# EAGLE design ZEROCROSS_ATmega328 (EAGLE 6.5.0)
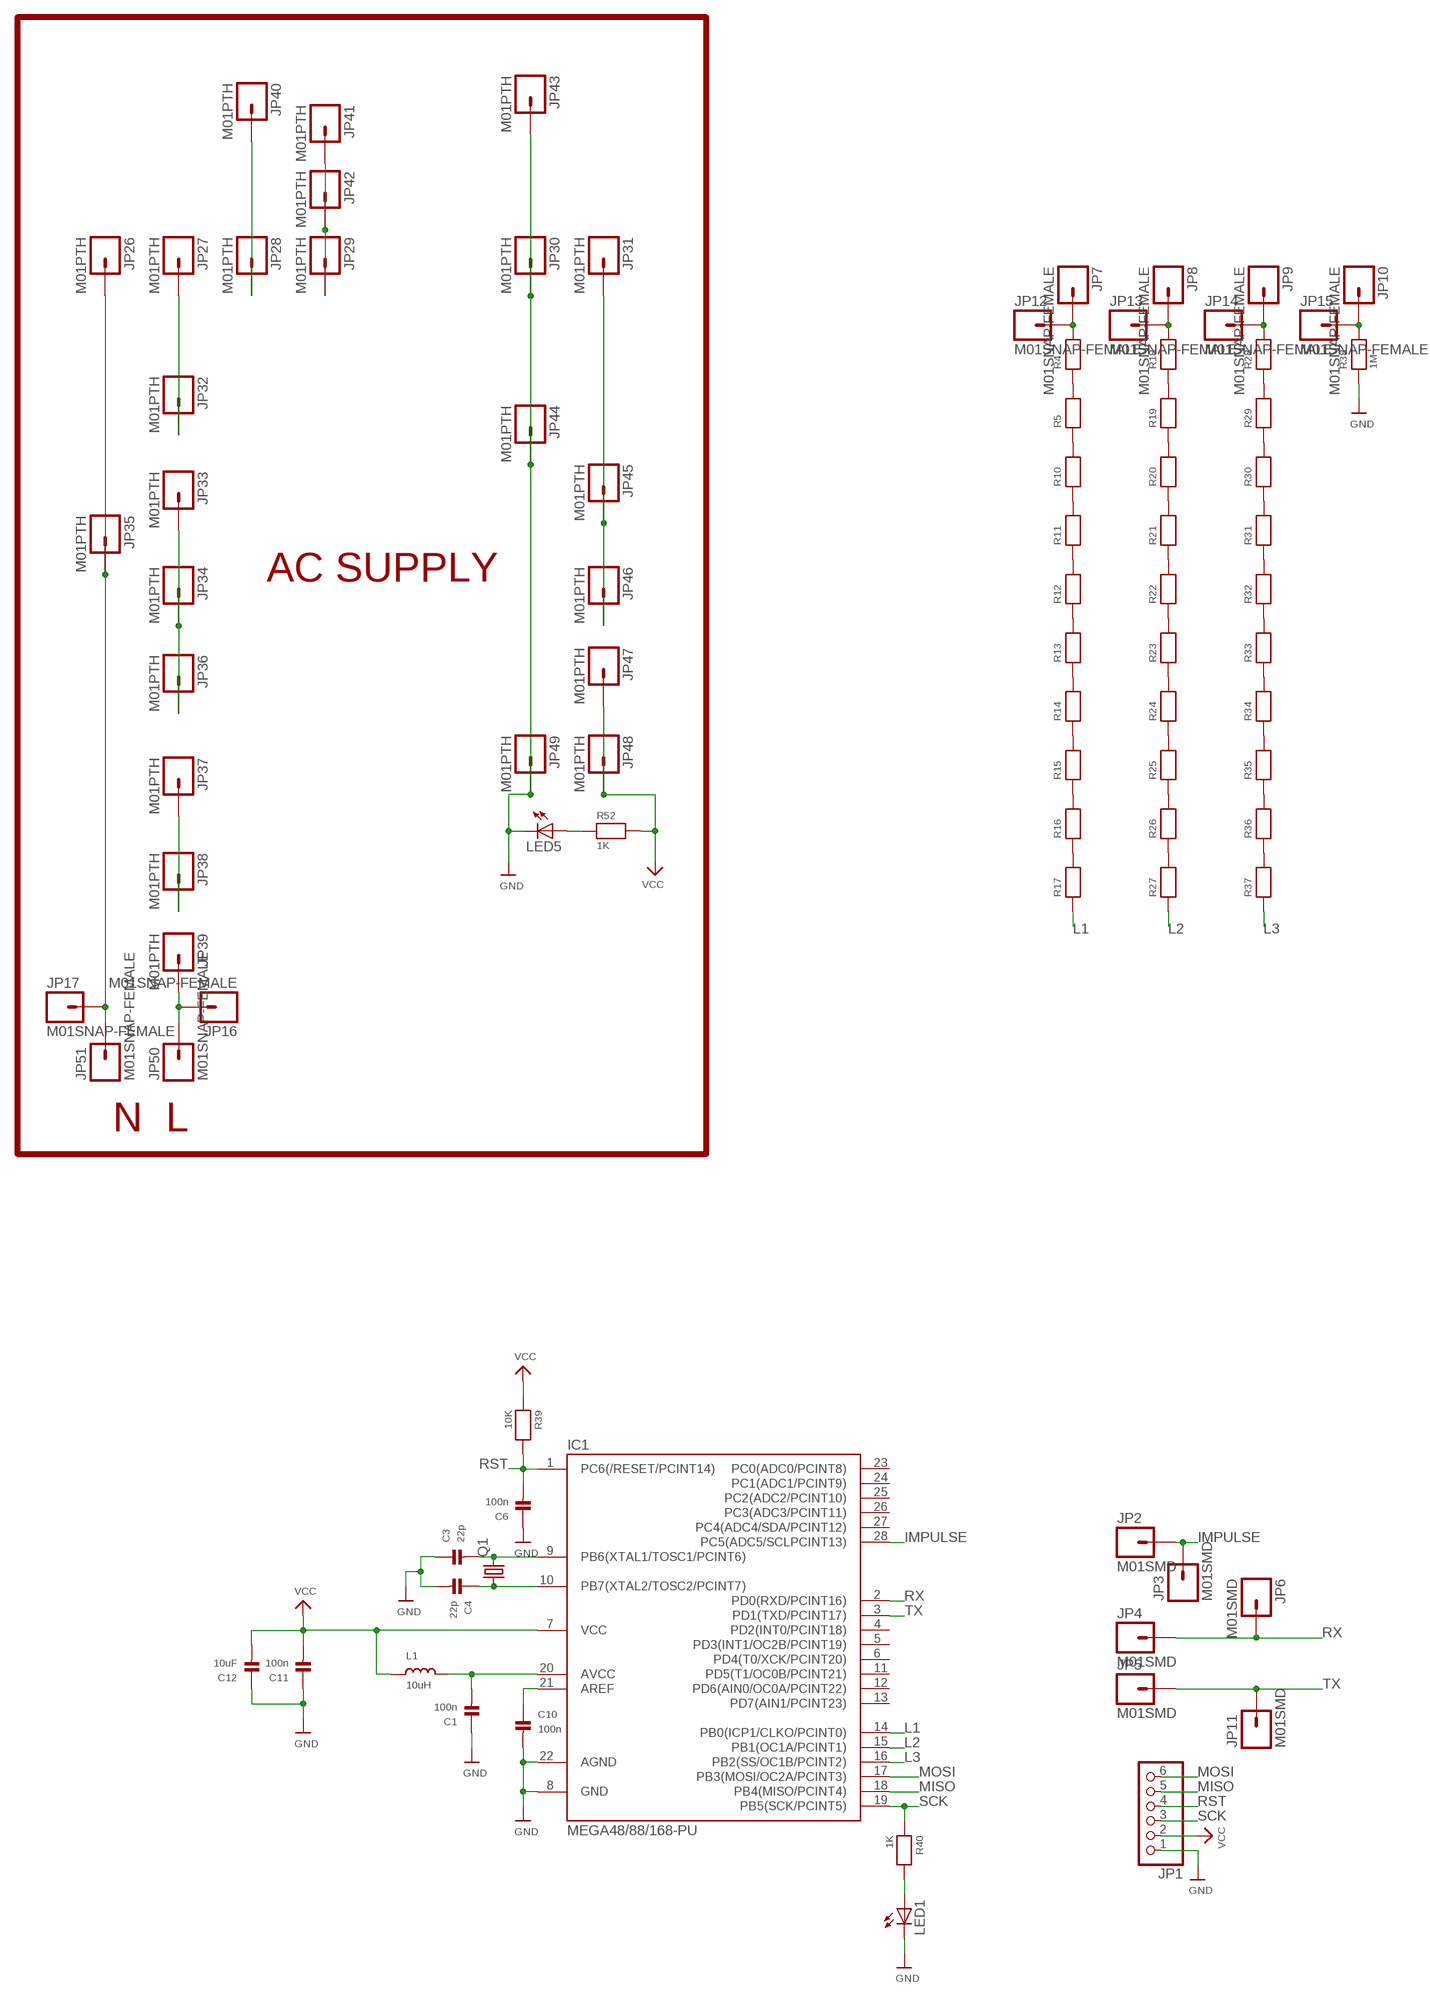
[diagram p0: schematic, sheet 1]

## Parts
C1  100n  CAP_CERAMIC_0805MP  [_0805MP]
C3  22p  CAP_CERAMIC_0805MP  [_0805MP]
C4  22p  CAP_CERAMIC_0805MP  [_0805MP]
C6  100n  CAP_CERAMIC_0805MP  [_0805MP]
C10  100n  CAP_CERAMIC_0805MP  [_0805MP]
C11  100n  CAP_CERAMIC_0805MP  [_0805MP]
C12  10uF  CAP_CERAMIC_0805MP  [_0805MP]
IC1  MEGA48/88/168-PU  [DIL28-3]
JP1  HEADER-1X6  [1X06_OVAL]
JP2  M01SMD  [LUXEON-PAD]
JP3  M01SMD  [LUXEON-PAD]
JP4  M01SMD  [LUXEON-PAD]
JP5  M01SMD  [LUXEON-PAD]
JP6  M01SMD  [LUXEON-PAD]
JP7  M01SNAP-FEMALE  [SNAP-FEMALE]
JP8  M01SNAP-FEMALE  [SNAP-FEMALE]
JP9  M01SNAP-FEMALE  [SNAP-FEMALE]
JP10  M01SNAP-FEMALE  [SNAP-FEMALE]
JP11  M01SMD  [LUXEON-PAD]
JP12  M01SNAP-FEMALE  [SNAP-FEMALE]
JP13  M01SNAP-FEMALE  [SNAP-FEMALE]
JP14  M01SNAP-FEMALE  [SNAP-FEMALE]
JP15  M01SNAP-FEMALE  [SNAP-FEMALE]
JP16  M01SNAP-FEMALE  [SNAP-FEMALE]
JP17  M01SNAP-FEMALE  [SNAP-FEMALE]
JP26  M01PTH  [1X01]
JP27  M01PTH  [1X01]
JP28  M01PTH  [1X01]
JP29  M01PTH  [1X01]
JP30  M01PTH  [1X01]
JP31  M01PTH  [1X01]
JP32  M01PTH  [1X01]
JP33  M01PTH  [1X01]
JP34  M01PTH  [1X01]
JP35  M01PTH  [1X01]
JP36  M01PTH  [1X01]
JP37  M01PTH  [1X01]
JP38  M01PTH  [1X01]
JP39  M01PTH  [1X01]
JP40  M01PTH  [1X01]
JP41  M01PTH  [1X01]
JP42  M01PTH  [1X01]
JP43  M01PTH  [1X01]
JP44  M01PTH  [1X01]
JP45  M01PTH  [1X01]
JP46  M01PTH  [1X01]
JP47  M01PTH  [1X01]
JP48  M01PTH  [1X01]
JP49  M01PTH  [1X01]
JP50  M01SNAP-FEMALE  [SNAP-FEMALE]
JP51  M01SNAP-FEMALE  [SNAP-FEMALE]
L1  10uH  INDUCTOR_0805MP  [_0805MP]
LED1  LED-3MM-NO_SILK  [LED3MM-NS]
LED5  LED-3MM-NO_SILK  [LED3MM-NS]
Q1  CRYSTALHC49U-V  [HC49U-V]
R4  RESISTOR1206  [1206]
R5  RESISTOR1206  [1206]
R10  RESISTOR1206  [1206]
R11  RESISTOR1206  [1206]
R12  RESISTOR1206  [1206]
R13  RESISTOR1206  [1206]
R14  RESISTOR1206  [1206]
R15  RESISTOR1206  [1206]
R16  RESISTOR1206  [1206]
R17  RESISTOR1206  [1206]
R18  RESISTOR1206  [1206]
R19  RESISTOR1206  [1206]
R20  RESISTOR1206  [1206]
R21  RESISTOR1206  [1206]
R22  RESISTOR1206  [1206]
R23  RESISTOR1206  [1206]
R24  RESISTOR1206  [1206]
R25  RESISTOR1206  [1206]
R26  RESISTOR1206  [1206]
R27  RESISTOR1206  [1206]
R28  RESISTOR1206  [1206]
R29  RESISTOR1206  [1206]
R30  RESISTOR1206  [1206]
R31  RESISTOR1206  [1206]
R32  RESISTOR1206  [1206]
R33  RESISTOR1206  [1206]
R34  RESISTOR1206  [1206]
R35  RESISTOR1206  [1206]
R36  RESISTOR1206  [1206]
R37  RESISTOR1206  [1206]
R38  1M  RESISTOR1206  [1206]
R39  10K  RESISTOR_0805MP  [_0805MP]
R40  1K  RESISTOR_0805MP  [_0805MP]
R52  1K  RESISTOR_0805MP  [_0805MP]

## Nets
IMPULSE: IC1.28(PC5(ADC5/SCLPCINT13)) JP2.P$1 JP3.P$1
L1: IC1.14(PB0(ICP1/CLKO/PCINT0)) R17.1
L2: IC1.15(PB1(OC1A/PCINT1)) R27.1
L3: IC1.16(PB2(SS/OC1B/PCINT2)) R37.1
MISO: IC1.18(PB4(MISO/PCINT4)) JP1.5
MOSI: IC1.17(PB3(MOSI/OC2A/PCINT3)) JP1.6
N$2: C1.2 IC1.20(AVCC) L1.2
N$4: C11.2 C12.2 IC1.7(VCC) JP1.2 JP47.1 JP48.1 L1.1 R39.1 R52.2 ; supply symbol labelled VCC
N$5: R4.1 R5.2
N$6: R5.1 R10.2
N$7: R10.1 R11.2
N$8: R11.1 R12.2
N$9: R12.1 R13.2
N$14: R13.1 R14.2
N$15: R14.1 R15.2
N$16: R15.1 R16.2
N$17: R16.1 R17.2
N$18: R18.1 R19.2
N$19: R19.1 R20.2
N$20: R20.1 R21.2
N$21: R21.1 R22.2
N$22: R22.1 R23.2
N$23: R23.1 R24.2
N$24: R24.1 R25.2
N$25: R25.1 R26.2
N$26: R26.1 R27.2
N$27: R28.1 R29.2
N$28: R29.1 R30.2
N$29: R30.1 R31.2
N$30: R31.1 R32.2
N$31: R32.1 R33.2
N$32: R33.1 R34.2
N$33: R34.1 R35.2
N$34: R35.1 R36.2
N$35: R36.1 R37.2
N$36: C3.2 IC1.9(PB6(XTAL1/TOSC1/PCINT6)) Q1.2
N$37: C4.1 IC1.10(PB7(XTAL2/TOSC2/PCINT7)) Q1.1
N$38: C10.1 IC1.21(AREF)
N$39: C1.1 C3.1 C4.2 C6.1 C10.2 C11.1 C12.1 IC1.8(GND) IC1.22(AGND) JP1.1 JP30.1 JP43.1 JP44.1 JP49.1 LED1.K(C) LED5.K(C) R38.1 ; supply symbol labelled GND
N$40: JP7.1 JP12.1 R4.2
N$41: JP8.1 JP13.1 R18.2
N$42: JP9.1 JP14.1 R28.2
N$43: JP10.1 JP15.1 R38.2
N$45: LED1.A R40.2
N$60: JP17.1 JP26.1 JP35.1 JP51.1
N$61: JP27.1 JP32.1
N$62: JP33.1 JP34.1 JP36.1
N$63: JP37.1 JP38.1
N$64: JP16.1 JP39.1 JP50.1
N$65: JP28.1 JP40.1
N$66: JP29.1 JP41.1 JP42.1
N$68: JP31.1 JP45.1 JP46.1
N$70: LED5.A R52.1
RST: C6.2 IC1.1(PC6(/RESET/PCINT14)) JP1.4 R39.2
RX: IC1.2(PD0(RXD/PCINT16)) JP4.P$1 JP6.P$1
SCK: IC1.19(PB5(SCK/PCINT5)) JP1.3 R40.1
TX: IC1.3(PD1(TXD/PCINT17)) JP5.P$1 JP11.P$1
Unconnected: IC1.4(PD2(INT0/PCINT18)) IC1.5(PD3(INT1/OC2B/PCINT19)) IC1.6(PD4(T0/XCK/PCINT20)) IC1.11(PD5(T1/OC0B/PCINT21)) IC1.12(PD6(AIN0/OC0A/PCINT22)) IC1.13(PD7(AIN1/PCINT23)) IC1.23(PC0(ADC0/PCINT8)) IC1.24(PC1(ADC1/PCINT9)) IC1.25(PC2(ADC2/PCINT10)) IC1.26(PC3(ADC3/PCINT11)) IC1.27(PC4(ADC4/SDA/PCINT12))

## Notes on the sheet
- AC SUPPLY
- N  L

## Library data of the parts
C1 C3 C4 C6 C10-C12 = microbuilder:CAP_CERAMIC: Ceramic Capacitors 0402 - 0402 Surface Mount Capacitors 16pF 50V 5% [Digikey: 445-4899-2-ND] 18pF 50V 5% [Digikey: 490-1281-2-ND] 22pF 50V 5% [Digikey: 490-1283-2-ND] 68pF 50V 5% [Digikey: 490-1289-2-ND] 0.1uF 10V 10% [Digikey: 490-1318-2-ND] 1.0uF 6.3V 10% [Digikey: 490-1320-2-ND] 0603 - 0603 Surface Mount Capacitors 16 pF 50V 5% [Digikey: 445-5051-2-ND] 22 pF 50V [Digikey: PCC220ACVTR-ND] 33 pF 50V 5% [Digikey: 490-1415-1-ND] 56pF 50V 5% [Digikey: 490-1421-1-ND] 220pF 50V 5% [Digikey: 445-1285-1-ND] 680 pF 50V 2200 pF 50V 5% C0G [Digikey: 445-1297-1-ND] 5600 pF 100V 5% X7R [Digikey: 478-3711-1-ND] 0.1 µF 25V 10% [Digikey: PCC2277TR-ND] 0.22 µF 16V 10% X7R [Digikey: 445-1318-1-ND] 1.0 µF 25V 10% [Digikey: 445-5146-2-ND] 0603 - RF Specific 3pF 250V +/-0.1pF RF [Digikey: 712-1347-1-ND] 18 pF 250V 5% [Digikey: 478-3505-1-ND or 712-1322-1-ND] 56 pF 250V 5% C0G RF [Digikey: 490-4867-1-ND] 68 pF 250V RF [Digikey: 490-4868-1-ND] 0805 - 0805 Surface Mount Capacitors 220 pF 250V 2% RF Ceramic Capacitor [Digikey: 712-1398-1-ND] 1000 pF 50V 2% NP0 Ceramic Capacitor [Digikey: 478-3760-1-ND] 0.1 µF 25V 10% Ceramic Capacitor [Digikey: PCC1828TR-ND] 1.0 µF 16V 10% Ceramic Capacitor[Digikey: 490-1691-2-ND] 10.0 µF 10V 10% Ceramic Capacitor[Digikey: 709-1228-1-ND] 10.0 uF 16V 10% Ceramic Capacitor [Digikey: 478-5165-2-ND] 47 uF 6.3V 20% Ceramic Capacitor [Digikey: 587-1779-1-ND or 399-5506-1-ND] 1206 - 1206 Surface Mount Capacitors 47uF 10V 20% Ceramic Capacitor [Digikey: 490-5528-1-ND or 399-5508-1-ND or 445-6010-1-ND] 100uF 6.3V -20%, +80% Y5V Ceramic Capacitor (Digikey: 490-4512-1-ND, Mouser: 81-GRM31CF50J107ZE1L)
IC1 = avr-7:MEGA48/88/168-PU
JP1 = microbuilder:HEADER-1X6: PIN HEADER
JP2-JP17 JP26-JP51 = SparkFun-Connectors:M01: Header 1 Standard 1-pin 0.1" header. Use with straight break away headers (SKU : PRT-00116), right angle break away headers (PRT-00553), swiss pins (PRT-00743), machine pins (PRT-00117), and female headers (PRT-00115).
L1 = microbuilder:INDUCTOR: Inductors 0603: 10nH Ceramic Inductor - microwire antenna/RF (Digikey: 712-1434-2-ND) 0805: 560nH Ceramic Inductor - RF (Digikey: 553-1047-1-ND) 270nH Ceramic Inductor - Q = 40@250MHz, +-5%, 1 Ohm DC Resistance (Digikey: 535-10506-2-ND) 1007 (2518 Metric) SMT: 10µH 10% 250mOhm 820mA 1007 Inductor (Digikey: 587-2189-1-ND) 22µH 10% 500mOhm 580mA 1007 Inductor (Digikey: 587-2190-1-ND) 47µH 10% 950mOhm 420mA 1007 Inductor (Digikey: 587-2191-1-ND) 47µH 5% 100mOhm 1A 1008 Inductor (Digikey: 732-1816-1-ND) 5.0x5.0mm (Taiyo Yuden NR5040 Series) 6.8µH 20% 2.3A 64mOhm Inductor (Digikey: 587-2374-2-ND) 5.0x5.0mm (TDK VLC5045 Series) 4.7µH 20% 3.3A 34mOhm Inductor (Digikey: 445-6526-1-ND) 6.8µH 20% 2.7A 46mOhm Inductor (Digikey: 445-6527-1-ND) 6.0x6.0mm (TDK VLC6045 Series) 4.7µH 20% 3.8A 27mOhm Inductor (Digikey: 445-6538-2-ND) 6.8µH 20% 3A 41mOhm Inductor (Digikey: 445-6540-1-ND) 6.2µH 30% 2.2A 45mOhm Inductor (Digikey: SRR5028-6R2YCT-ND) - Not TDK VLC6045 but footprint should match 6.0x6.0mm (TDK SLF6045 Series) 6.8uH 30% 2A 33mOhm Inductor (Digikey: 445-4572-1-ND, Mouser: 810-SLF645T6R8N2R0PF)
LED1 LED5 = SparkFun-LED:LED: LEDs Standard schematic elements and footprints for 5mm, 3mm, 1206, and 0603 sized LEDs. 5mm - Spark Fun Electronics SKU : COM-00529 (and others)
Q1 = crystal:CRYSTAL: CRYSTAL; OC_FARNELL: 1666969; OC_NEWARK: unknown
R4 R5 R10-R40 R52 = microbuilder:RESISTOR: Resistors 0402 - 0402 Surface Mount Package 22 Ohm 1% 1/16W [Digikey: 311-22.0LRTR-ND] 33 Ohm 5% 1/16W 1.0K 5% 1/16W 1.5K 5% 1/16W 2.0K 1% 1/16W 10.0K 1% 1/16W [Digikey: 311-10.0KLRTR-ND] 10.0K 5% 1/16W [Digikey: RMCF0402JT10K0TR-ND] 12.1K 1% 1/16W [Digikey: 311-22.0LRTR-ND] 100.0K 5% 1/16W 0603 - 0603 Surface Mount Package 0 Ohm 1/10 Watt 1% Resistor 15 Ohm 1/10 Watt 1% Resistor 33 Ohm 1/10 Watt 1% Resistor 49.9 Ohm 1/10 Watt 1% Resistor 100 Ohm 1/10 Watt 1% Resistor 150 Ohm 1/10 Watt 1% Resistor 240 Ohm 1/10 Watt 1% Resistor 390 Ohm 1/10 Watt 1% Resistor 560 Ohm 1/10 Watt 1% Resistor 680 Ohm 1/10 Watt 1% Resistor 750 Ohm 1/10 Watt 1% Resistor 1.0K Ohm 1/10 Watt 1% Resistor 1.5K Ohm 1/10 Watt 1% Resistor 2.0K Ohm 1/10 Watt 1% Resistor 2.2K Ohm 1/10 Watt 1% Resistor 3.3K Ohm 1/10 Watt 1% Resistor 4.7K Ohm 1/10 Watt 1% Resistor 10.0K Ohm 1/10 Watt 1% Resistor 12.0K Ohm 1/10 Watt 1% Resistor 12.1K Ohm 1/10 Watt 1% Resistor 20.0K Ohm 1/10 Watt 1% Resistor 33.0K Ohm 1/10 Watt 1% Resistor 100.0K Ohm 1/10 Watt 1% Resistor 0805 - 0805 Surface Mount Package 0 Ohm 1/8 Watt 1% Resistor 33 Ohm 1/8 Watt 1% Resistor 100 Ohm 1/8 Watt 1% Resistor 150 Ohm 1/8 Watt 1% Resistor 200 Ohm 1/8 Watt 1% Resistor 240 Ohm 1/8 Watt 1% Resistor 330 Ohm 1/8 Watt 1% Resistor 390 Ohm 1/8 Watt 1% Resistor 470 Ohm 1/8 Watt 1% Resistor 1.0K Ohm 1/8 Watt 1% Resistor 1.5K Ohm 1/8 Watt 1% Resistor 2.0K Ohm 1/8 Watt 1% Resistor 4.7K Ohm 1/8 Watt 1% Resistor 5.1K Ohm 1/8 Watt 1% Resistor 5.6K Ohm 1/8 Watt 1% Resistor 10.0K Ohm 1/8 Watt 1% Resistor 22.0K Ohm 1/8 Watt 1% Resistor 33.0K Ohm 1/8 Watt 1% Resistor 100K Ohm 1/8 Watt 1% Resistor 1206 - 1206 Surface Mount Package 2012 - 2010 Surface Mount Package 0.11 Ohm 1/2 Watt 1% Resistor - Digikey: RHM.11UCT-ND

## Board
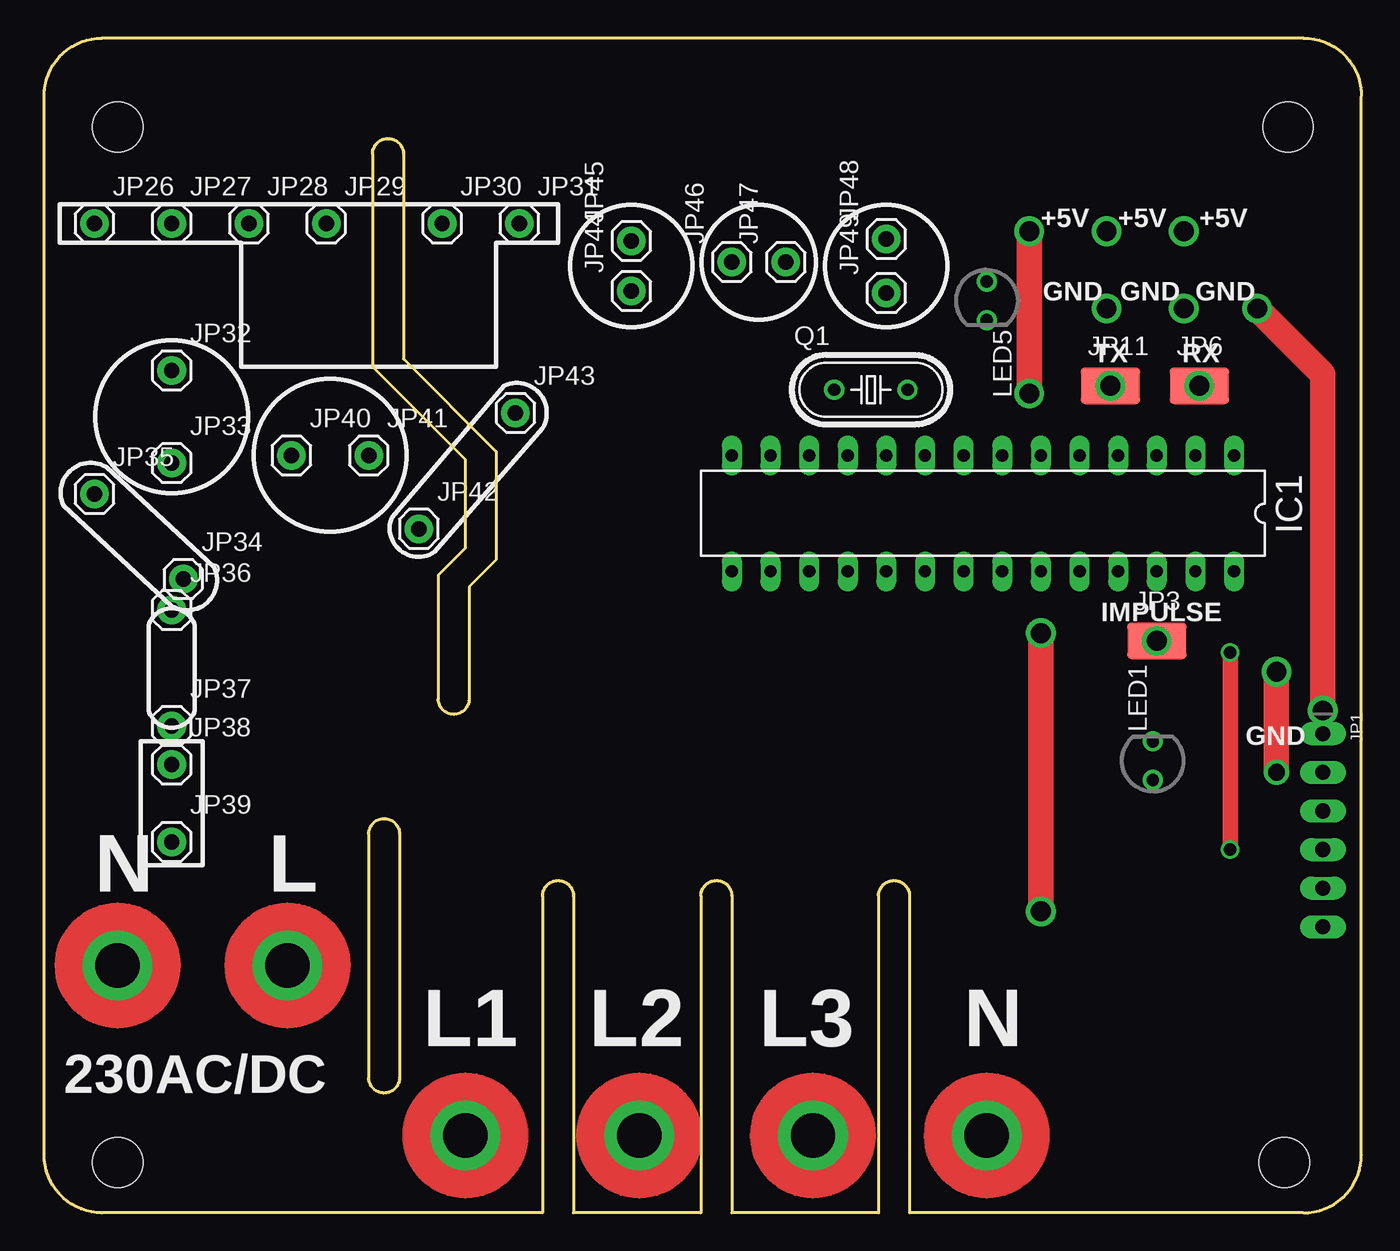
[diagram p1: board, top side]
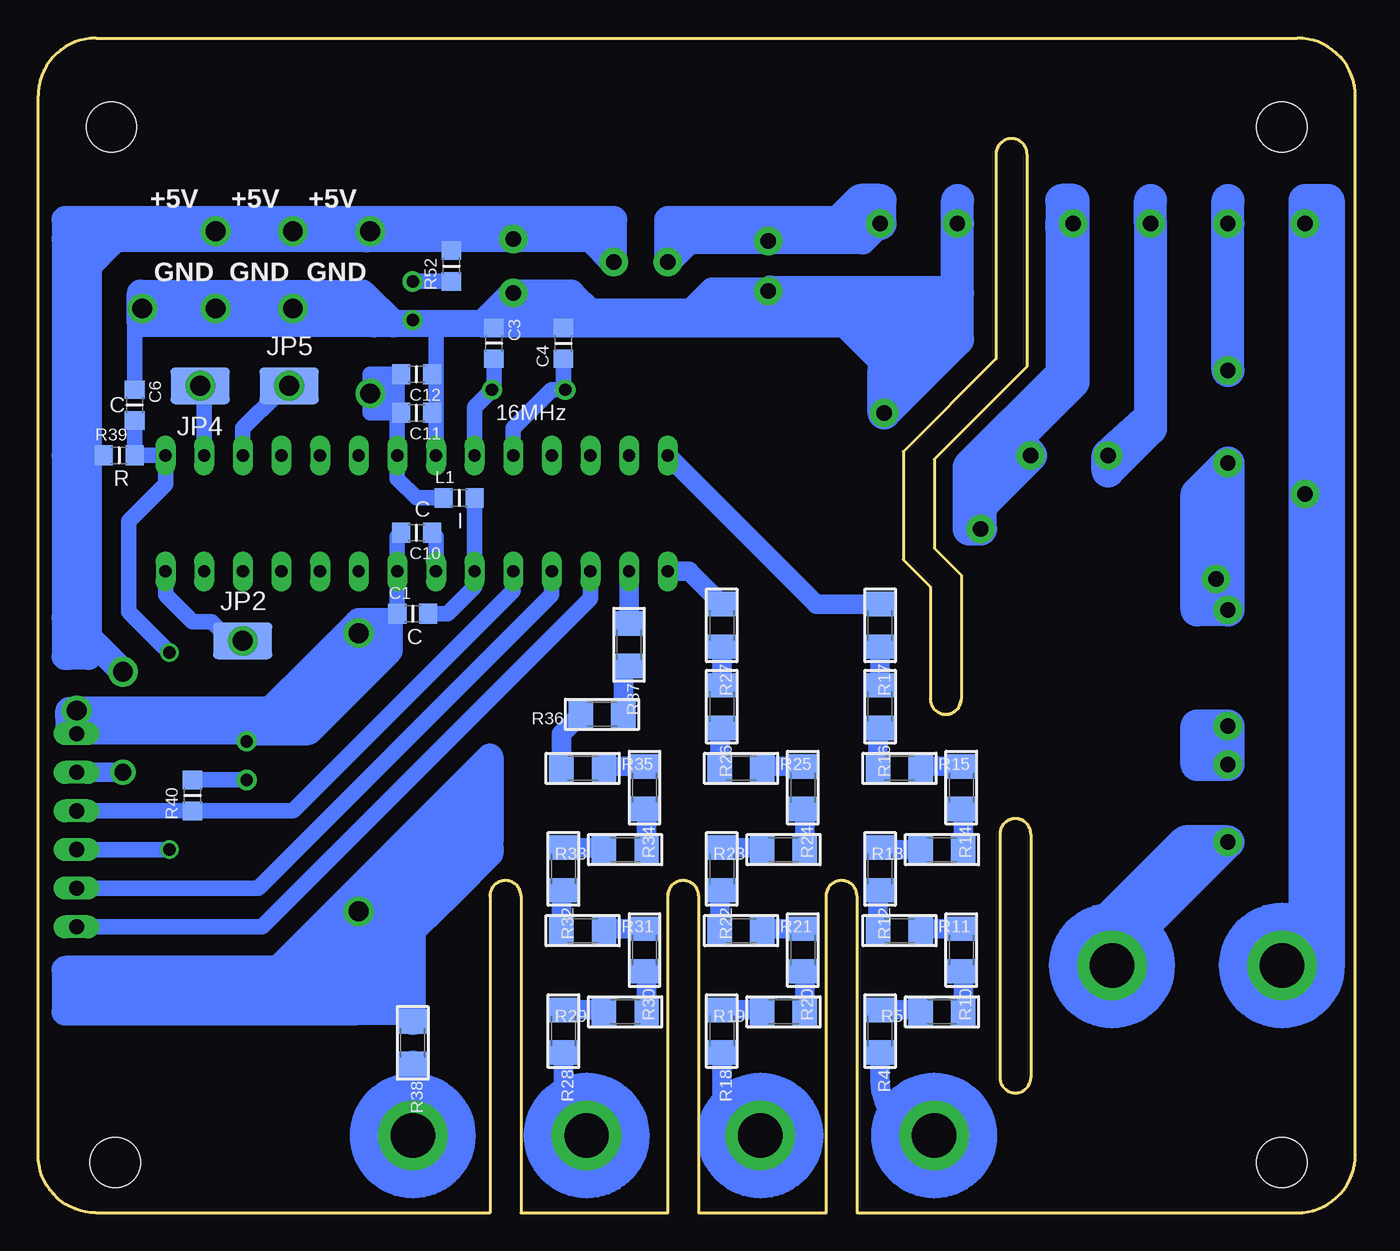
[diagram p2: board, bottom side, seen from below]

Size 86.61 x 77.22 mm. Coordinates in mm from the lower left corner, seen from the top.
Outline: 21.34,24.89 21.34,8.89 arc180 23.37,8.89 23.37,24.89 arc180 21.34,24.89
Outline: 21.59,69.6 21.59,55.63 27.69,49.53 27.69,43.69 25.91,41.91 25.91,33.78 arc180 27.94,33.78 27.94,41.15 29.72,42.93 29.72,50.04 23.62,56.13 23.62,69.6 arc180 21.59,69.6
Outline: 0,3.81 0,73.41 arc-90 3.81,77.22 82.8,77.22 arc-90 86.61,73.41 86.61,3.81 arc-90 82.8,0 56.9,0 56.9,20.83 arc180 54.86,20.83 54.86,0 45.21,0 45.21,20.83 arc180 43.18,20.83 43.18,0 34.8,0 34.8,20.83 arc180 32.77,20.83 32.77,0 3.81,0 arc-90 0,3.81
Copper layers (1*16): Top 0.035mm / dielectric 1.5mm / Bottom 0.035mm
Design rules "default *": minimum track width 10mil, minimum drill 24mil, track to track 8mil, track to pad 8mil, pad to pad 8mil, via to via 8mil, smd to smd 8mil, copper to edge 40mil, drill to drill 8mil, minimum pad ring 10mil, minimum via ring 8mil, stop-mask expansion 4mil, vias tented up to drill 0mil, thermal gap 10mil
tKeepout: area 0.8,12.2 to 8.8,20.3; area 0.8,12.2 to 8.8,20.3; area 12,12.2 to 20,20.3; area 23.7,1.1 to 31.7,9.1; area 35.1,1.1 to 43.1,9.1; area 46.5,1.1 to 54.6,9.1; area 58,1.1 to 66,9.1
bKeepout: area 66.3,63.2 to 78.5,65.8
tRestrict: area 0.8,12.2 to 8.8,20.3; area 12,12.2 to 20,20.3; area 23.7,1.1 to 31.7,9.1; area 35.1,1.1 to 43.1,9.1; area 46.5,1.1 to 54.6,9.1; area 58,1.1 to 66,9.1
bRestrict: area 66.3,63.2 to 69.8,65.8; area 74.9,63.2 to 78.5,65.8; area 69.3,63.2 to 75.4,65.8

### Footprints (pad centres in the part's own frame; a part is rotated, then mirrored left to right if it is on the bottom)
_0805MP = smd 1.2 x 1.3: 1 -1.016,0; 2 1.016,0
DIL28-3 = drill 0.813 long: 1 -16.51,-3.81; 2 -13.97,-3.81; 3 -11.43,-3.81; 4 -8.89,-3.81; 5 -6.35,-3.81; 6 -3.81,-3.81; 7 -1.27,-3.81; 8 1.27,-3.81; 9 3.81,-3.81; 10 6.35,-3.81; 11 8.89,-3.81; 12 11.43,-3.81; 13 13.97,-3.81; 14 16.51,-3.81; 15 16.51,3.81; 16 13.97,3.81; 17 11.43,3.81; 18 8.89,3.81; 19 6.35,3.81; 20 3.81,3.81; 21 1.27,3.81; 22 -1.27,3.81; 23 -3.81,3.81; 24 -6.35,3.81; 25 -8.89,3.81; 26 -11.43,3.81; 27 -13.97,3.81; 28 -16.51,3.81
1X06_OVAL = drill 1 long: 1 -6.35,0; 2 -3.81,0; 3 -1.27,0; 4 1.27,0; 5 3.81,0; 6 6.35,0
LUXEON-PAD = smd 3.9 x 2.4: P$1 0,0
SNAP-FEMALE = drill 2.921 pad 4.572: 1 0,0
1X01 = drill 1.016 pad 1.88: 1 0,0
LED3MM-NS = drill 0.813: A -1.27,0; K 1.27,0
HC49U-V = drill 0.813: 1 -2.413,0; 2 2.413,0
1206 = smd 1.6 x 1.8: 1 -1.4,0; 2 1.4,0
STAND-OFF = hole 3.302: 0,0

### Placement (x,y rotation side)
C1  61.98,39.37 0 bottom
C3  56.64,57.15 270 bottom
C4  52.07,57.15 90 bottom
C6  80.26,53.09 270 bottom
C10  61.72,44.7 180 bottom
C11  61.72,52.58 180 bottom
C12  61.72,55.12 180 bottom
IC1  61.72,45.97 180 top
JP1  84.07,25.15 270 top
JP2  73.15,37.59 0 bottom
JP3  73.15,37.59 0 top
JP4  75.95,54.36 180 bottom
JP5  70.1,54.36 0 bottom
JP6  75.95,54.36 0 top
JP7  27.69,5.08 270 bottom
JP8  39.12,5.08 270 bottom
JP9  50.55,5.08 270 bottom
JP10  61.98,5.08 270 bottom
JP11  70.1,54.36 0 top
JP12  27.69,5.08 0 top
JP13  39.12,5.08 0 top
JP14  50.55,5.08 0 top
JP15  61.98,5.08 0 top
JP16  16,16.26 0 top
JP17  4.83,16.26 0 top
JP26  3.3,65.02 0 top
JP27  8.38,65.02 0 top
JP28  13.46,65.02 0 top
JP29  18.54,65.02 0 top
JP30  26.16,65.02 0 top
JP31  31.24,65.02 0 top
JP32  8.38,55.37 0 top
JP33  8.38,49.28 0 top
JP34  9.14,41.66 0 top
JP35  3.3,47.24 0 top
JP36  8.38,39.62 0 top
JP37  8.38,32 0 top
JP38  8.38,29.46 0 top
JP39  8.38,24.38 0 top
JP40  16.26,49.78 0 top
JP41  21.34,49.78 0 top
JP42  24.64,44.96 0 top
JP43  30.99,52.58 0 top
JP44  38.61,60.58 90 top
JP45  38.61,63.88 90 top
JP46  45.21,62.48 90 top
JP47  48.77,62.48 90 top
JP48  55.37,64.01 90 top
JP49  55.37,60.45 90 top
JP50  16,16.26 0 bottom
JP51  4.83,16.26 0 bottom
L1  58.93,46.99 0 bottom
LED1  72.9,29.72 90 top
LED5  61.98,59.94 270 top
Q1  54.36,54.1 0 top
R4  31.24,11.94 270 bottom
R5  27.18,13.21 180 bottom
R10  25.91,17.27 270 bottom
R11  29.97,18.54 0 bottom
R12  31.24,22.61 270 bottom
R13  27.18,23.88 180 bottom
R14  25.91,27.94 270 bottom
R15  29.97,29.21 0 bottom
R16  31.24,33.27 270 bottom
R17  31.24,38.61 270 bottom
R18  41.66,11.94 270 bottom
R19  37.59,13.21 180 bottom
R20  36.32,17.27 270 bottom
R21  40.39,18.54 0 bottom
R22  41.66,22.61 270 bottom
R23  37.59,23.88 180 bottom
R24  36.32,27.94 270 bottom
R25  40.39,29.21 0 bottom
R26  41.66,33.27 270 bottom
R27  41.66,38.61 270 bottom
R28  52.07,11.94 270 bottom
R29  48.01,13.21 180 bottom
R30  46.74,17.27 270 bottom
R31  50.8,18.54 0 bottom
R32  52.07,22.61 270 bottom
R33  48.01,23.88 180 bottom
R34  46.74,27.94 270 bottom
R35  50.8,29.21 0 bottom
R36  49.53,32.77 180 bottom
R37  47.75,37.34 270 bottom
R38  61.98,11.18 270 bottom
R39  81.28,49.78 0 bottom
R40  76.45,27.43 90 bottom
R52  59.44,62.23 90 bottom
STANDOFF1  STAND-OFF  [STAND-OFF]  81.79,71.37 0 top
STANDOFF2  STAND-OFF  [STAND-OFF]  4.83,71.37 0 top
STANDOFF3  STAND-OFF  [STAND-OFF]  4.83,3.3 0 top
STANDOFF4  STAND-OFF  [STAND-OFF]  81.53,3.3 0 top

### Tracks (layer width: path | path; a pad name or v marks a point on that pad's centre or on a via)
IMPULSE  (via drill 1.3)
  Bottom 1.016: IC1.28 78.23,40.64 76.45,38.86 75.18,38.86 73.91,37.59 JP3.P$1
  other vias: 73.15,37.59
L1
  Bottom 1.27: R17.1 35.44,40.01 IC1.14
L2
  Bottom 1.27: IC1.15 43.81,42.16 R27.1
L3
  Bottom 1.27: R37.1 IC1.16
MISO
  Bottom 1.016: IC1.18 52.83,40.64 72.14,21.34 JP1.5
MOSI
  Bottom 1.016: IC1.17 50.29,40.39 71.88,18.8 JP1.6
N$1
  Bottom 1.778: 63.75,38.86 65.53,38.86 70.87,32
N$2
  Bottom 1.016: L1.2 IC1.20 57.91,41.15 59.69,39.37 C1.2
N$3
  Bottom 1.778: 64.52,38.35 68.58,34.29 70.1,34.29 | 70.1,34.29 65.53,38.86 65.79,37.59 66.04,37.85 67.31,36.58 67.31,36.32 68.33,35.31 | 70.1,34.29 71.37,33.02 84.07,33.02 | 84.07,33.02 84.58,32.51 | 84.58,32.51 84.58,31.75 | 84.58,32.51 84.58,33.02 84.07,33.02
N$4  (via drill 1.1, 1.3)
  Top 1.676: v64.77,53.85 v64.77,64.52 | v81.03,28.96 v81.03,35.56
  Bottom 1.016: 55.63,65.28 57.15,63.75 59.44,63.75 R52.2 | L1.1 61.72,46.99 62.99,48.26 IC1.7 62.99,52.58 | 62.99,52.58 62.99,52.83 | 62.99,52.83 62.99,53.85 | 62.99,52.83 C11.2 62.99,52.58 | 62.99,53.85 62.99,55.12 C12.2 63.5,55.12 | 62.99,53.85 v64.77,53.85 | R39.1 84.84,49.78 | v64.77,53.85 63.5,55.12 | v64.77,53.85 63.5,52.58 | 63.5,52.58 62.99,52.58 | 63.5,55.12 64.77,55.12 v64.77,53.85 | v64.77,53.85 64.77,52.58 63.5,52.58
  Bottom 1.27: v64.77,64.52 64.77,64.01 65.02,64.01 | JP1.2 v81.03,28.96
  Bottom 1.778: 83.57,64.52 83.31,64.26 83.31,62.23 | 83.31,62.23 83.31,36.58 84.58,36.58 | JP48.1 50.29,64.01 JP47.1 48.77,65.28 55.63,65.28 | 55.63,65.28 55.63,64.01 JP48.1 | JP48.1 65.02,64.01 84.84,64.01 | 55.63,65.28 84.84,65.28 84.84,64.01 | 84.84,64.01 84.84,49.78 84.84,39.12 | 84.84,39.12 84.84,36.58 84.58,36.58 | 80.52,64.77 81.79,63.75 83.31,62.23 | v81.03,35.56 84.58,39.12 84.84,39.12 | 84.84,39.12 84.58,38.86 84.58,36.58
N$5
  Bottom 1.27: R4.1 28.58,13.34 R5.2
N$6
  Bottom 1.27: R10.2 25.78,15.87 R5.1
N$7
  Bottom 1.27: R10.1 28.57,18.67 R11.2
N$8
  Bottom 1.27: R11.1 31.37,21.21 R12.2
N$9
  Bottom 1.27: R13.2 31.24,23.88 R12.1
N$10
  Bottom 1.016: 63.75,53.59 63.25,53.09
N$11
  Bottom 1.778: 68.33,36.07 71.37,33.02 73.91,32.77
N$12  (via drill 1.3)
  other vias: 69.85,64.52
N$13
  Bottom 1.778: 57.66,27.69 70.61,14.73 84.33,14.73 84.07,14.48 84.07,13.46 83.82,13.72 82.55,13.72 | 82.55,13.72 70.1,13.72 58.42,25.4 | 57.66,26.16 58.42,25.4 | 58.42,25.4 58.17,23.11 | 82.55,13.72 84.33,13.21 67.56,13.21 60.71,19.81 | 60.71,19.81 59.44,21.08 | 59.44,21.08 59.44,23.11 68.83,13.72 68.83,13.21 | 56.9,24.13 56.9,23.62 59.44,21.08 | 60.71,19.81 60.71,22.1 60.45,22.35
N$14
  Bottom 1.27: R13.1 25.78,26.54 R14.2
N$15
  Bottom 1.27: R14.1 28.57,29.34 R15.2
N$16
  Bottom 1.27: R15.1 31.37,31.87 R16.2
N$17
  Bottom 1.27: R16.1 R17.2
N$18
  Bottom 1.27: R19.2 38.99,13.34 R18.1
N$19
  Bottom 1.27: R19.1 36.19,15.87 R20.2
N$20
  Bottom 1.27: R20.1 38.99,18.67 R21.2
N$21
  Bottom 1.27: R21.1 41.79,21.21 R22.2
N$22
  Bottom 1.27: R23.2 38.99,24.01 R22.1
N$23
  Bottom 1.27: R24.2 36.19,26.41 R23.1
N$24
  Bottom 1.27: R24.1 38.99,29.34 R25.2
N$25
  Bottom 1.27: R25.1 41.79,31.87 R26.2
N$26
  Bottom 1.27: R26.1 R27.2
N$27
  Bottom 1.27: R29.2 49.41,13.34 R28.1
N$28
  Bottom 1.27: R29.1 46.61,15.87 R30.2
N$29
  Bottom 1.27: R30.1 49.4,18.67 R31.2
N$30
  Bottom 1.27: R31.1 52.2,21.21 R32.2
N$31
  Bottom 1.27: R33.2 49.41,24.01 R32.1
N$32
  Bottom 1.27: R33.1 46.61,26.54 R34.2
N$33
  Bottom 1.27: R34.1 48.13,29.34 49.41,29.33 R35.2
N$34
  Bottom 1.27: R35.1 52.2,31.5 R36.2
N$35
  Bottom 1.27: R36.1 48.13,35.56 R37.2
N$36
  Bottom 1.016: C3.2 56.64,54.23 Q1.2 57.91,52.96 IC1.9
N$37
  Bottom 1.016: C4.1 52.07,54.23 Q1.1 52.83,54.1 55.37,51.56 IC1.10
N$38
  Bottom 1.016: IC1.21 60.45,44.45 C10.1
N$39  (via drill 1.3)
  Top 1.676: v79.76,59.44 84.07,55.12 v84.07,33.02 | v65.53,19.81 v65.53,38.1
  Bottom 0.813: C4.2 52.07,58.93 55.37,58.93 | C3.1 56.64,58.42
  Bottom 1.016: JP49.1 57.15,58.67 LED5.K | IC1.8 60.45,52.58 | 60.45,52.58 60.45,55.12 | 60.45,55.12 60.45,58.17 60.71,58.42 | C12.1 60.45,55.12 | C11.1 60.45,52.58 | C10.2 62.99,44.45 IC1.22 C1.1 63.25,39.12 | C6.1 80.26,60.45 77.98,60.45 | LED1.K 72.9,31.24 72.64,31.5 | 70.87,31.5 v84.07,33.02 | v65.53,38.1 64.9,38.99 63.37,38.99
  Bottom 1.422: JP1.1 72.64,31.5 70.87,31.5 63.5,38.86 63.37,38.99 63.25,39.12
  Bottom 1.778: 73.28,31.88 73.15,31.88 72.9,31.62 68.83,31.62 63.5,36.96 63.5,38.86 | 55.63,60.2 57.4,58.42 | 57.4,58.42 60.71,58.42 63.25,58.42 | 64.52,58.42 79.88,58.42 79.88,60.45 77.98,60.45 65.28,60.45 63.25,58.42 | 63.25,58.42 64.52,58.42 | 64.52,58.42 65.53,59.44 v69.85,59.44 v74.93,59.44 v79.76,59.44 78.23,59.44 | 57.4,58.42 56.64,58.42 55.37,58.42 | 26.16,60.45 26.16,60.71 38.48,60.71 JP44.1 42.29,60.58 43.69,59.18 50.29,59.18 51.56,60.45 JP49.1 55.37,58.93 55.37,58.42 | 55.37,58.42 30.99,58.42 26.67,58.42 26.67,59.44 35.05,59.44 42.16,59.44 42.16,58.67 51.05,58.67 51.05,59.44 54.36,59.44 | R38.1 61.98,13.21 | 61.98,13.21 61.98,19.81 v65.53,19.81 | 56.9,24.38 56.9,29.97 70.87,16 84.84,16 84.84,13.21 65.79,13.21 | 61.98,13.21 65.79,13.21 | 65.79,13.21 62.74,16.26 62.74,14.48 63.25,13.97
  Bottom 2.184: 30.99,55.37 JP43.1 26.16,57.4 26.16,60.45 JP30.1 26.16,66.55 | 30.99,58.42 30.99,55.37 | 30.99,55.37 29.46,55.37 29.46,58.17 29.72,58.17 29.72,57.4 28.19,57.4 | 31.24,56.39 34.29,59.44 35.05,59.44
N$40
  Bottom 1.27: R4.2 31.24,8.64 arc-90 JP12.1
N$41
  Bottom 1.27: R18.2 41.66,7.62 arc-90 JP13.1
N$42
  Bottom 1.27: R28.2 52.07,6.6 arc-90 JP14.1
N$43
  Bottom 1.778: JP15.1 R38.2
N$44  (via drill 1.3)
  other vias: 74.93,64.52
N$45
  Bottom 1.016: R40.2 LED1.A
N$60
  Bottom 1.27: JP17.1 3.3,16.26
  Bottom 2.184: 3.3,16.26 JP35.1 JP26.1 | JP26.1 1.78,65.02 | 1.78,65.02 1.78,16.26 JP17.1 | JP26.1 3.3,66.55 1.78,66.55 1.78,65.02
N$61
  Bottom 2.184: JP32.1 JP27.1 8.38,66.55
N$62
  Bottom 2.184: 8.38,41.66 JP36.1 10.41,39.62 10.41,47.24 JP33.1 8.38,41.66 | 8.38,41.66 JP34.1
N$63
  Bottom 2.184: JP37.1 JP38.1 10.41,29.46 10.41,32 JP37.1
N$64
  Bottom 2.184: JP16.1 16,16.76 JP39.1 11.18,24.38 16.76,18.8
N$65
  Bottom 2.184: JP28.1 13.46,64.26 | JP28.1 13.46,52.32 | 13.46,52.32 JP40.1 16.26,48.77 13.46,51.56 13.46,52.32 | JP28.1 13.46,66.55
N$66
  Bottom 2.184: JP29.1 18.54,54.61 22.23,50.93 | JP42.1 24.64,48.51 22.23,50.93 | 22.23,50.93 22.23,50.67 JP41.1 24.38,46.74 | JP29.1 19.3,65.02 | 19.3,65.02 19.3,64.77 19.3,55.12 25.4,49.02 25.4,44.96 24.89,44.96 | JP29.1 18.54,66.55 19.3,66.55 19.3,65.02
N$68
  Bottom 1.778: JP31.1 32.38,63.88 JP45.1 43.81,63.88 JP46.1 45.21,65.28 31.24,65.28
  Bottom 2.184: JP31.1 31.24,66.55 32.51,66.55 | 32.51,66.55 32.51,65.79 | 32.51,66.55 34.29,64.77
N$70
  Bottom 1.016: R52.1 LED5.A
RST  (via drill 0.8)
  Top 1.016: v77.98,36.83 v77.98,23.88
  Bottom 1.016: C6.2 R39.2 IC1.1 78.23,47.88 80.64,45.47 80.64,39.5 v77.98,36.83 | v77.98,23.88 JP1.4
RX  (via drill 1.3)
  Bottom 1.016: IC1.2 75.69,54.36 JP6.P$1
  other vias: 75.95,54.36
SCK
  Bottom 1.016: IC1.19 55.37,40.89 69.85,26.42 R40.1 JP1.3
TX  (via drill 1.3)
  Bottom 1.016: IC1.3 73.15,51.56 70.87,53.85 JP11.P$1
  other vias: 70.1,54.36

### Text on the board
tPlace: +5V | +5V | +5V | GND | GND | GND | TX | RX | IMPULSE | GND | N | L | L1 | L2 | L3 | N | 230AC/DC
bPlace: +5V | +5V | +5V | GND | GND | GND | C | 16MHz | R | C | I | C